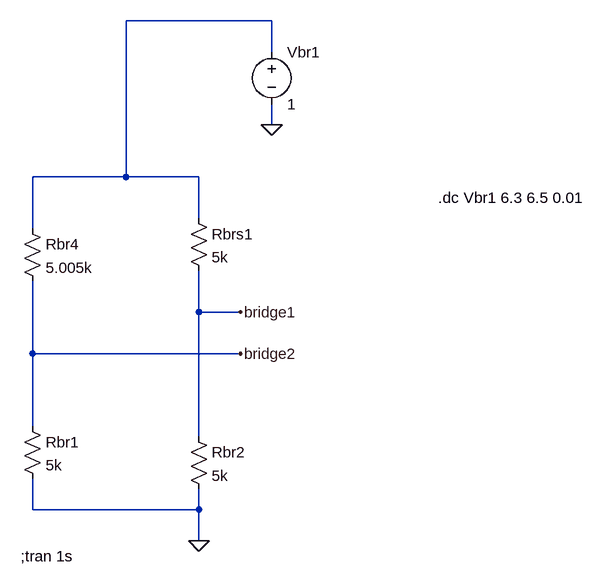
[diagram p0: schematic bridge_supply_influence.asc]
bridge_supply_influence.asc, the LTspice schematic file:
Version 4
SHEET 1 880 680
WIRE 304 -176 80 -176
WIRE 304 -128 304 -176
WIRE 304 -16 304 -48
WIRE 80 64 80 -176
WIRE 80 64 -64 64
WIRE 192 64 80 64
WIRE 192 128 192 64
WIRE -64 144 -64 64
WIRE 192 272 192 208
WIRE 256 272 192 272
WIRE -64 336 -64 224
WIRE 256 336 -64 336
WIRE -64 448 -64 336
WIRE 192 464 192 272
WIRE -64 576 -64 528
WIRE 192 576 192 544
WIRE 192 576 -64 576
WIRE 192 624 192 576
FLAG 192 624 0
FLAG 256 272 bridge1
FLAG 256 336 bridge2
FLAG 304 -16 0
SYMBOL res -80 432 R0
SYMATTR InstName Rbr1
SYMATTR Value 5k
SYMBOL res 176 112 R0
SYMATTR InstName Rbrs1
SYMATTR Value 5k
SYMBOL res 176 448 R0
SYMATTR InstName Rbr2
SYMATTR Value 5k
SYMBOL res -80 128 R0
SYMATTR InstName Rbr4
SYMATTR Value 5.005k
SYMBOL voltage 304 -144 R0
WINDOW 123 0 0 Left 0
WINDOW 39 0 0 Left 0
SYMATTR InstName Vbr1
SYMATTR Value 1
TEXT -82 648 Left 2 !;tran 1s
TEXT 560 96 Left 2 !.dc Vbr1 6.3 6.5 0.01

The netlist it stands for:
* bridge_supply_influence.asc
Rbr1 bridge2 0 5k
Rbrs1 N001 bridge1 5k
Rbr2 bridge1 0 5k
Rbr4 N001 bridge2 5.005k
Vbr1 N001 0 1
;tran 1s
.dc Vbr1 6.3 6.5 0.01
.backanno
.end